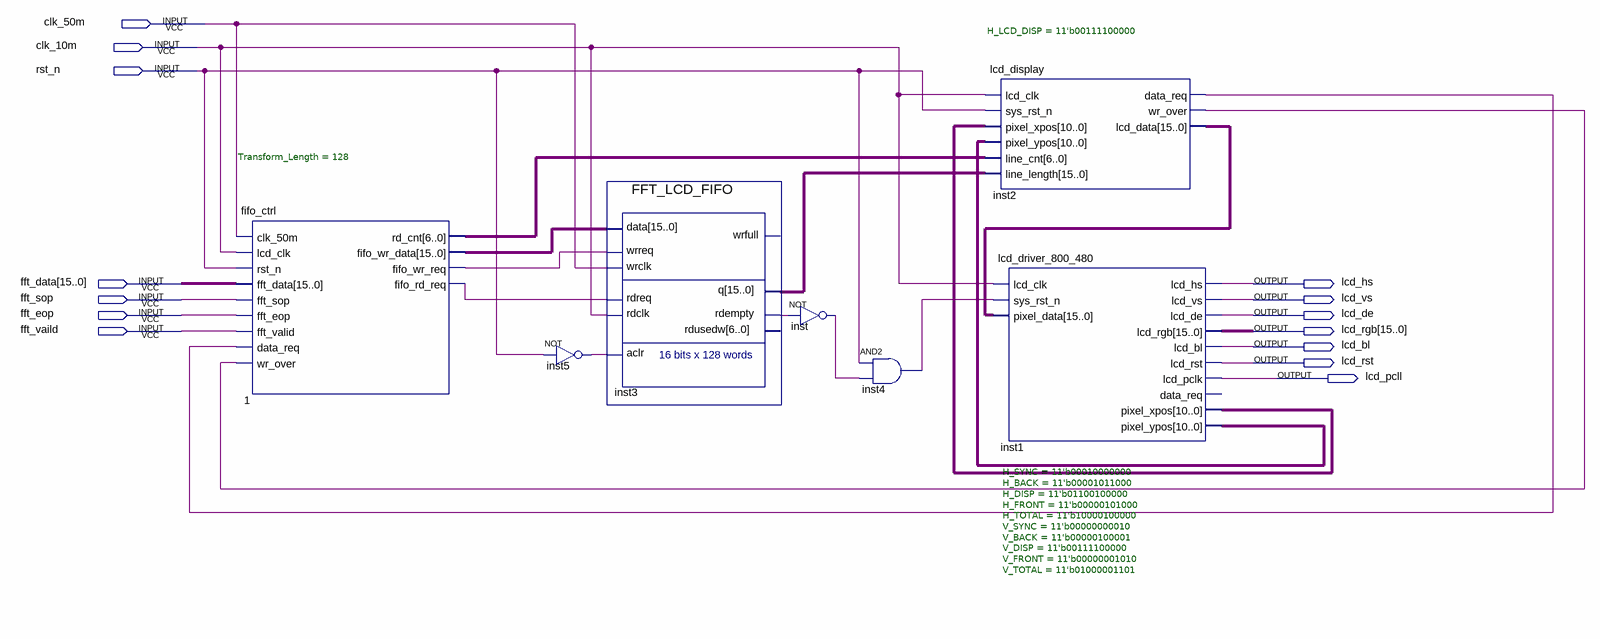
[diagram p0: schematic sheet]
// Quartus schematic lcd_top.bdf as structural Verilog: 7 symbols, 14 pins
module lcd_top (
  input  clk_50m,
  input  clk_10m,
  input  rst_n,
  input  [15:0] fft_data,
  input  fft_sop,
  input  fft_eop,
  input  fft_vaild,
  output lcd_hs,
  output lcd_vs,
  output lcd_de,
  output [15:0] lcd_rgb,
  output lcd_bl,
  output lcd_rst,
  output lcd_pcll
);

  wire inst2_data_req, inst2_wr_over, inst3_rdempty, inst4_out, inst5_out, inst_out, n1_fifo_rd_req,
       n1_fifo_wr_req;
  wire [6:0] n1_rd_cnt;
  wire [10:0] inst1_pixel_xpos, inst1_pixel_ypos;
  wire [15:0] inst2_lcd_data, inst3_q, n1_fifo_wr_data;

  fifo_ctrl #(.Transform_Length(128)) u_1 (
    .clk_50m(clk_50m), .lcd_clk(clk_10m), .rst_n(rst_n), .fft_data(fft_data), .fft_sop(fft_sop),
    .fft_eop(fft_eop), .fft_valid(fft_vaild), .data_req(inst2_data_req), .wr_over(inst2_wr_over),
    .rd_cnt(n1_rd_cnt), .fifo_wr_data(n1_fifo_wr_data), .fifo_wr_req(n1_fifo_wr_req),
    .fifo_rd_req(n1_fifo_rd_req));
  not inst5 (inst5_out, rst_n);
  FFT_LCD_FIFO inst3 (
    .data(n1_fifo_wr_data), .wrreq(n1_fifo_wr_req), .wrclk(clk_50m), .rdreq(n1_fifo_rd_req), .rdclk(clk_10m),
    .aclr(inst5_out), .q(inst3_q), .rdempty(inst3_rdempty));  // open: wrfull, rdusedw
  not inst (inst_out, inst3_rdempty);
  and inst4 (inst4_out, rst_n, inst_out);
  lcd_display #(.H_LCD_DISP(11'b00111100000)) inst2 (
    .lcd_clk(clk_10m), .sys_rst_n(rst_n), .pixel_xpos(inst1_pixel_xpos), .pixel_ypos(inst1_pixel_ypos),
    .line_cnt(n1_rd_cnt), .line_length(inst3_q), .data_req(inst2_data_req), .wr_over(inst2_wr_over),
    .lcd_data(inst2_lcd_data));
  lcd_driver_800_480 #(.H_SYNC(11'b00010000000), .H_BACK(11'b00001011000), .H_DISP(11'b01100100000), .H_FRONT(11'b00000101000), .H_TOTAL(11'b10000100000), .V_SYNC(11'b00000000010), .V_BACK(11'b00000100001), .V_DISP(11'b00111100000), .V_FRONT(11'b00000001010), .V_TOTAL(11'b01000001101)) inst1 (
    .lcd_clk(clk_10m), .sys_rst_n(inst4_out), .pixel_data(inst2_lcd_data), .lcd_hs(lcd_hs), .lcd_vs(lcd_vs),
    .lcd_de(lcd_de), .lcd_rgb(lcd_rgb), .lcd_bl(lcd_bl), .lcd_rst(lcd_rst), .lcd_pclk(lcd_pcll),
    .pixel_xpos(inst1_pixel_xpos), .pixel_ypos(inst1_pixel_ypos));  // open: data_req
endmodule
